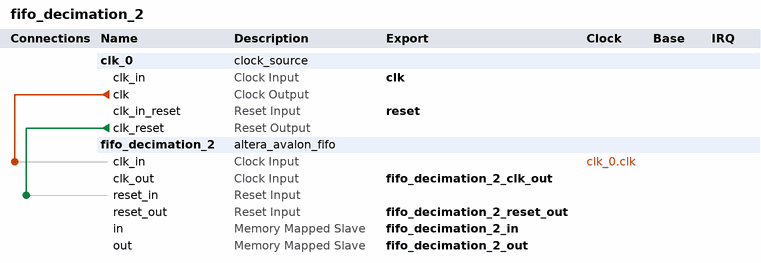
[diagram p0: system contents]
# Platform Designer (Qsys) system fifo_decimation_2, Cyclone V 5CEBA4F23C7
# Parameters at their usual value, and those the tool derives, are not listed.
package require -exact qsys 17.0
create_system fifo_decimation_2
set_project_property DEVICE_FAMILY {Cyclone V}
set_project_property DEVICE 5CEBA4F23C7

add_instance clk_0 clock_source 17.0
set_instance_parameter_value clk_0 clockFrequency 50000000

add_instance fifo_decimation_2 altera_avalon_fifo 17.0
set_instance_parameter_value fifo_decimation_2 bitsPerSymbol 16
set_instance_parameter_value fifo_decimation_2 channelWidth 8
set_instance_parameter_value fifo_decimation_2 errorWidth 8
set_instance_parameter_value fifo_decimation_2 fifoDepth 32
set_instance_parameter_value fifo_decimation_2 fifoInputInterfaceOptions AVALONMM_WRITE
set_instance_parameter_value fifo_decimation_2 fifoOutputInterfaceOptions AVALONMM_READ
set_instance_parameter_value fifo_decimation_2 singleClockMode false
set_instance_parameter_value fifo_decimation_2 symbolsPerBeat 2
set_instance_parameter_value fifo_decimation_2 useIRQ true
set_instance_parameter_value fifo_decimation_2 usePacket true
set_instance_parameter_value fifo_decimation_2 useReadControl false
set_instance_parameter_value fifo_decimation_2 useWriteControl false

# connections
add_connection clk_0.clk fifo_decimation_2.clk_in clock
add_connection clk_0.clk_reset fifo_decimation_2.reset_in reset

# exported interfaces
add_interface clk clock sink
set_interface_property clk EXPORT_OF clk_0.clk_in
add_interface fifo_decimation_2_clk_out clock sink
set_interface_property fifo_decimation_2_clk_out EXPORT_OF fifo_decimation_2.clk_out
add_interface fifo_decimation_2_in avalon slave
set_interface_property fifo_decimation_2_in EXPORT_OF fifo_decimation_2.in
add_interface fifo_decimation_2_out avalon slave
set_interface_property fifo_decimation_2_out EXPORT_OF fifo_decimation_2.out
add_interface fifo_decimation_2_reset_out reset sink
set_interface_property fifo_decimation_2_reset_out EXPORT_OF fifo_decimation_2.reset_out
add_interface reset reset sink
set_interface_property reset EXPORT_OF clk_0.clk_in_reset

set_interconnect_requirement {$system} qsys_mm.clockCrossingAdapter HANDSHAKE
set_interconnect_requirement {$system} qsys_mm.enableEccProtection FALSE
set_interconnect_requirement {$system} qsys_mm.insertDefaultSlave FALSE
set_interconnect_requirement {$system} qsys_mm.maxAdditionalLatency 1

save_system fifo_decimation_2.qsys
